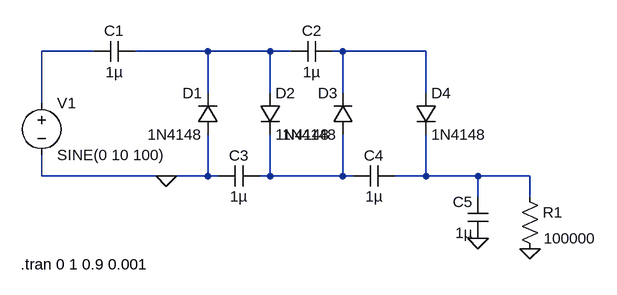
[diagram p0: schematic Problem 4.asc]
Problem 4.asc, the LTspice schematic file:
Version 4
SHEET 1 880 680
WIRE -144 112 -224 112
WIRE 32 112 -80 112
WIRE 128 112 32 112
WIRE 160 112 128 112
WIRE 240 112 224 112
WIRE 368 112 240 112
WIRE 32 176 32 112
WIRE 128 176 128 112
WIRE 240 176 240 112
WIRE 368 176 368 112
WIRE -224 192 -224 112
WIRE -224 304 -224 272
WIRE -32 304 -224 304
WIRE 32 304 32 240
WIRE 32 304 -32 304
WIRE 48 304 32 304
WIRE 128 304 128 240
WIRE 128 304 112 304
WIRE 240 304 240 240
WIRE 240 304 128 304
WIRE 256 304 240 304
WIRE 368 304 368 240
WIRE 368 304 320 304
WIRE 448 304 368 304
WIRE 528 304 448 304
WIRE 448 336 448 304
WIRE 528 336 528 304
FLAG -32 304 0
FLAG 448 400 0
FLAG 528 416 0
SYMBOL voltage -224 176 R0
WINDOW 123 0 0 Left 0
WINDOW 39 0 0 Left 0
SYMATTR InstName V1
SYMATTR Value SINE(0 10 100)
SYMBOL cap -80 96 R90
WINDOW 0 0 32 VBottom 2
WINDOW 3 32 32 VTop 2
SYMATTR InstName C1
SYMATTR Value 1µ
SYMBOL cap 224 96 R90
WINDOW 0 0 32 VBottom 2
WINDOW 3 32 32 VTop 2
SYMATTR InstName C2
SYMATTR Value 1µ
SYMBOL cap 112 288 R90
WINDOW 0 0 32 VBottom 2
WINDOW 3 32 32 VTop 2
SYMATTR InstName C3
SYMATTR Value 1µ
SYMBOL cap 320 288 R90
WINDOW 0 0 32 VBottom 2
WINDOW 3 32 32 VTop 2
SYMATTR InstName C4
SYMATTR Value 1µ
SYMBOL cap 464 400 R180
WINDOW 0 24 56 Left 2
WINDOW 3 24 8 Left 2
SYMATTR InstName C5
SYMATTR Value 1µ
SYMBOL diode 48 240 R180
WINDOW 0 24 64 Left 2
WINDOW 3 24 0 Left 2
SYMATTR InstName D1
SYMATTR Value 1N4148
SYMBOL diode 112 176 R0
SYMATTR InstName D2
SYMATTR Value 1N4148
SYMBOL diode 256 240 R180
WINDOW 0 24 64 Left 2
WINDOW 3 24 0 Left 2
SYMATTR InstName D3
SYMATTR Value 1N4148
SYMBOL diode 352 176 R0
SYMATTR InstName D4
SYMATTR Value 1N4148
SYMBOL res 512 320 R0
WINDOW 3 37 80 Left 2
SYMATTR Value 100000
SYMATTR InstName R1
TEXT -256 440 Left 2 !.tran 0 1 0.9 0.001

The netlist it stands for:
* Problem 4.asc
V1 N001 0 SINE(0 10 100)
C1 N002 N001 1µ
C2 N003 N002 1µ
C3 N004 0 1µ
C4 N005 N004 1µ
C5 0 N005 1µ
D1 0 N002 1N4148
D2 N002 N004 1N4148
D3 N004 N003 1N4148
D4 N003 N005 1N4148
R1 N005 0 100000
.model D D
.lib standard.dio
.tran 0 1 0.9 0.001
.backanno
.end